# EAGLE schematic deneme1 (EAGLE 9.6.2)
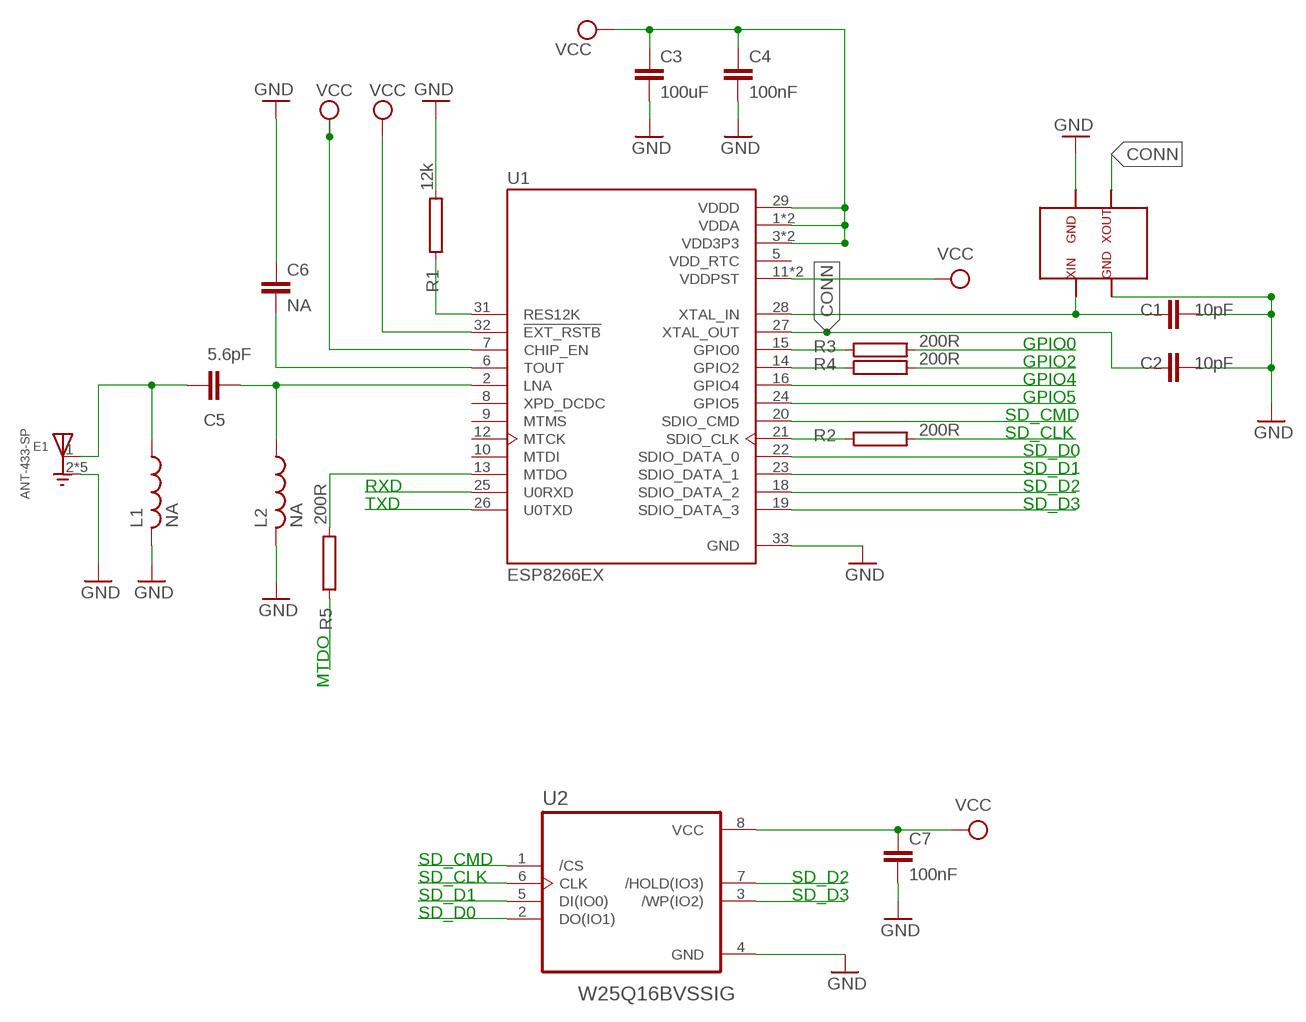
[diagram p0: schematic, sheet 1]

## Parts
C1  10pF  C5/2.5  [C5B2.5]
C2  10pF  C5/2.5  [C5B2.5]
C3  100uF  C5/2.5  [C5B2.5]
C4  100nF  C5/2.5  [C5B2.5]
C5  5.6pF  C5/2.5  [C5B2.5]
C6  NA  C5/2.5  [C5B2.5]
C7  100nF  C5/2.5  [C5B2.5]
E1  ANT-433-SP  [XDCR_ANT-433-SP]
L1  NA  L-US0204/5  [0204/5]
L2  NA  L-US0204/5  [0204/5]
R1  12k  RMG100-V  [TO-247-2V]
R2  200R  RMG100-V  [TO-247-2V]
R3  200R  RMG100-V  [TO-247-2V]
R4  200R  RMG100-V  [TO-247-2V]
R5  200R  RMG100-V  [TO-247-2V]
U1  ESP8266EX  [QFN50P500X500X80-33N]
U2  W25Q16BVSSIG  [SOIC127P790X216-8N]

## Nets
CONN: C2.1 U1.27(XTAL_OUT)
GND: C1.2 C2.2 C3.2 C4.2 C6.1 C7.2 E1.2(GND) E1.3(GND) E1.4(GND) E1.5(GND) E1.6(GND) L1.2 L2.2 R1.2 U1.33(GND) U2.4(GND)
N$1: R1.1 U1.31(RES12K)
N$2: U2.1(/CS)
N$3: C5.1 L2.1 U1.2(LNA)
N$4: C5.2 E1.1(FEEDING) L1.1
N$5: C6.2 U1.6(TOUT)
N$6: R5.2 U1.13(MTDO)
N$7: R5.1
N$8: R4.1 U1.14(GPIO2)
N$9: R4.2
N$10: R3.1 U1.15(GPIO0)
N$11: R3.2
N$12: U1.16(GPIO4)
N$13: U1.18(SDIO_DATA_2)
N$14: U1.19(SDIO_DATA_3)
N$15: U1.20(SDIO_CMD)
N$16: R2.1 U1.21(SDIO_CLK)
N$17: R2.2
N$18: U1.22(SDIO_DATA_0)
N$19: U1.23(SDIO_DATA_1)
N$20: U1.24(GPIO5)
N$21: U1.25(U0RXD)
N$22: U1.26(U0TXD)
N$23: C1.1 U1.28(XTAL_IN)
N$24: U2.2(DO(IO1))
N$25: U2.3(/WP(IO2))
N$26: U2.6(CLK)
N$27: U2.7(/HOLD(IO3))
N$29: U2.5(DI(IO0))
VCC: C3.1 C4.1 C7.1 U1.1(VDDA) U1.3(VDD3P3) U1.4(VDD3P3) U1.7(CHIP_EN) U1.11(VDDPST) U1.17(VDDPST) U1.29(VDDD) U1.30(VDDA) U1.32(!EXT_RSTB) U2.8(VCC)
Unconnected: U1.8(XPD_DCDC) U1.9(MTMS) U1.10(MTDI) U1.12(MTCK)

## Notes on the sheet
- GND | XOUT
- XIN | GND
- GPIO0
- GPIO2
- GPIO4
- GPIO5
- SD_CMD
- SD_CLK
- SD_D0
- SD_D1
- RXD | SD_D2
- TXD | SD_D3
- MTDO
- SD_CMD
- SD_CLK | SD_D2
- SD_D1 | SD_D3
- SD_D0

## Power pins joined to a net without a drawn wire
VDD_RTC: U1.5(VDD_RTC)

## Library data of the parts
C1-C7 = capacitor-wima:C: CAPACITOR naming: grid - package width
E1 = ANT-433-SP:ANT-433-SP: 315MHz Alarms, ISM, Remote Control, Security Systems Chip RF Antenna 312MHz ~ 317MHz Solder Surface Mount Check prices <https://pricing.snapeda.com/parts/ANT-433-SP/Linx%20Technologies/view-part?ref=eda>; AVAILABILITY: Good; DESCRIPTION: 433 MHz Monopole Chip Antenna; MF: Linx Technologies; MP: ANT-433-SP; PACKAGE: ANTENNA-1 Linx Technologies; PRICE: None; PURCHASE-URL: https://pricing.snapeda.com/search/part/ANT-433-SP/?ref=eda
L1 L2 = rcl:L-US: INDUCTOR, American symbol; SPICEPREFIX: L
R1-R5 = resistor-power:RMG100: TO-247 Power Resistor - RMG 100 Series Source: www.token.com.tw .. power-resistor-rmg100pdf; OC_FARNELL: unknown; OC_NEWARK: unknown
U1 = ESP8266EX:ESP8266EX: ESP8266EX, Highly Integrated Wi-Fi SoC. 32- VQFN, 5x5mm Check prices <https://pricing.snapeda.com/parts/ESP8266EX/Espressif%20Systems/view-part?ref=eda>; AVAILABILITY: Warning; DESCRIPTION: IC RF TxRx + MCU WiFi 802.11b/g/n 2.4GHz 32-VFQFN Exposed Pad; MF: Espressif Systems; MP: ESP8266EX; PACKAGE: VFQFN-32 Espressif Systems; PRICE: None; PURCHASE-URL: https://pricing.snapeda.com/search/part/ESP8266EX/?ref=eda
U2 = W25Q16BVSSIG:W25Q16BVSSIG: Flash, pin, soic, flash, Memory, Semiconductors and Actives, serial, ic Check prices <https://pricing.snapeda.com/parts/W25Q16BVSSIG/Winbond/view-part?ref=eda>; AVAILABILITY: Bad; DESCRIPTION: FLASH - NOR Memory IC 16Mb (2M x 8) SPI - Quad I/O 104MHz 8-SOIC; MF: Winbond; MP: W25Q16BVSSIG; PACKAGE: SOIC-8 Winbond; PRICE: None